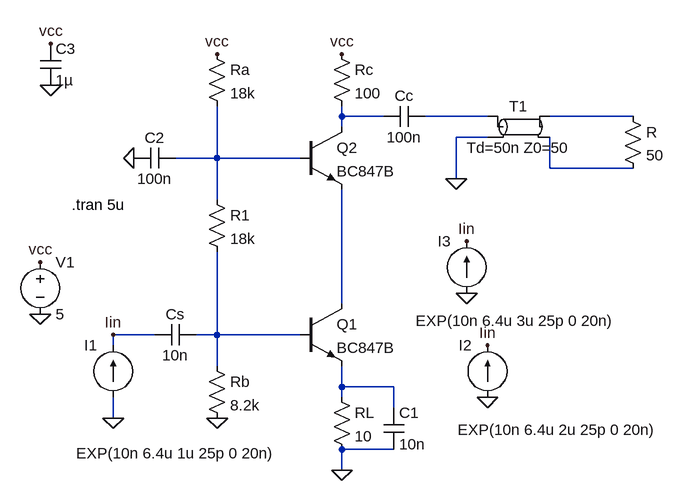
[diagram p0: schematic CASCODE_MPPC.asc]
CASCODE_MPPC.asc, the LTspice schematic file:
Version 4
SHEET 1 916 680
WIRE 416 -80 416 -96
WIRE 480 -80 416 -80
WIRE 640 -80 544 -80
WIRE 864 -80 736 -80
WIRE 416 -64 416 -80
WIRE 640 -48 592 -48
WIRE 224 -16 224 -96
WIRE 224 -16 160 -16
WIRE 352 -16 224 -16
WIRE 736 0 736 -48
WIRE 864 0 736 0
WIRE 592 16 592 -48
WIRE 224 48 224 -16
WIRE 416 208 416 32
WIRE 128 256 64 256
WIRE 224 256 224 128
WIRE 224 256 192 256
WIRE 352 256 224 256
WIRE 64 272 64 256
WIRE 224 304 224 256
WIRE 416 336 416 304
WIRE 496 336 416 336
WIRE 416 352 416 336
WIRE 496 368 496 336
WIRE 64 384 64 352
WIRE 496 432 416 432
WIRE 416 464 416 432
FLAG 224 384 0
FLAG -48 224 0
FLAG -48 144 vcc
FLAG 416 464 0
FLAG 64 384 0
FLAG 224 -176 vcc
FLAG 416 -176 vcc
FLAG 592 16 0
FLAG 96 -16 0
FLAG 640 352 0
FLAG 608 192 0
FLAG 64 256 Iin
FLAG 608 112 Iin
FLAG 640 272 Iin
FLAG -32 -128 0
FLAG -32 -192 vcc
SYMBOL npn 352 208 R0
SYMATTR InstName Q1
SYMATTR Value BC847B
SYMBOL Res 400 336 R0
SYMATTR InstName RL
SYMATTR Value 10
SYMBOL Res 400 -192 R0
SYMATTR InstName Rc
SYMATTR Value 100
SYMBOL Res 208 -192 R0
SYMATTR InstName Ra
SYMATTR Value 18k
SYMBOL Res 208 288 R0
SYMATTR InstName Rb
SYMATTR Value 8.2k
SYMBOL Cap 192 240 R90
WINDOW 0 0 32 VBottom 2
WINDOW 3 32 32 VTop 2
SYMATTR InstName Cs
SYMATTR Value 10n
SYMBOL tline 688 -64 R0
SYMATTR InstName T1
SYMBOL voltage -48 128 R0
SYMATTR InstName V1
SYMATTR Value 5
SYMBOL Cap 544 -96 R90
WINDOW 0 0 32 VBottom 2
WINDOW 3 32 32 VTop 2
SYMATTR InstName Cc
SYMATTR Value 100n
SYMBOL Res 848 -96 R0
SYMATTR InstName R
SYMATTR Value 50
SYMBOL current 64 352 R180
WINDOW 0 24 80 Left 2
WINDOW 3 -250 -86 Left 2
SYMATTR InstName I1
SYMATTR Value EXP(10n 6.4u 1u 25p 0 20n)
SYMBOL Cap 480 368 R0
SYMATTR InstName C1
SYMATTR Value 10n
SYMBOL npn 352 -64 R0
SYMATTR InstName Q2
SYMATTR Value BC847B
SYMBOL Cap 160 -32 R90
WINDOW 0 0 32 VBottom 2
WINDOW 3 32 32 VTop 2
SYMATTR InstName C2
SYMATTR Value 100n
SYMBOL Res 208 32 R0
SYMATTR InstName R1
SYMATTR Value 18k
SYMBOL current 640 352 R180
WINDOW 0 24 80 Left 2
WINDOW 3 -261 -50 Left 2
SYMATTR InstName I2
SYMATTR Value EXP(10n 6.4u 2u 25p 0 20n)
SYMBOL current 608 192 R180
WINDOW 0 24 80 Left 2
WINDOW 3 -228 -42 Left 2
SYMATTR InstName I3
SYMATTR Value EXP(10n 6.4u 3u 25p 0 20n)
SYMBOL Cap -48 -192 R0
SYMATTR InstName C3
SYMATTR Value 1µ
TEXT 0 56 Left 2 !.tran 5u

The netlist it stands for:
* CASCODE_MPPC.asc
Q1 N006 N007 N008 0 BC847B
RL N008 0 10
Rc vcc N001 100
Ra vcc N004 18k
Rb N007 0 8.2k
Cs N007 Iin 10n
T1 N002 0 N003 N005 Td=50n Z0=50
V1 vcc 0 5
Cc N002 N001 100n
R N003 N005 50
I1 0 Iin EXP(10n 6.4u 1u 25p 0 20n)
C1 N008 0 10n
Q2 N001 N004 N006 0 BC847B
C2 N004 0 100n
R1 N004 N007 18k
I2 0 Iin EXP(10n 6.4u 2u 25p 0 20n)
I3 0 Iin EXP(10n 6.4u 3u 25p 0 20n)
C3 vcc 0 1µ
.model NPN NPN
.model PNP PNP
.lib standard.bjt
.tran 5u
.backanno
.end